# EAGLE schematic RasPi-BplusHAT (EAGLE 7.3.0)
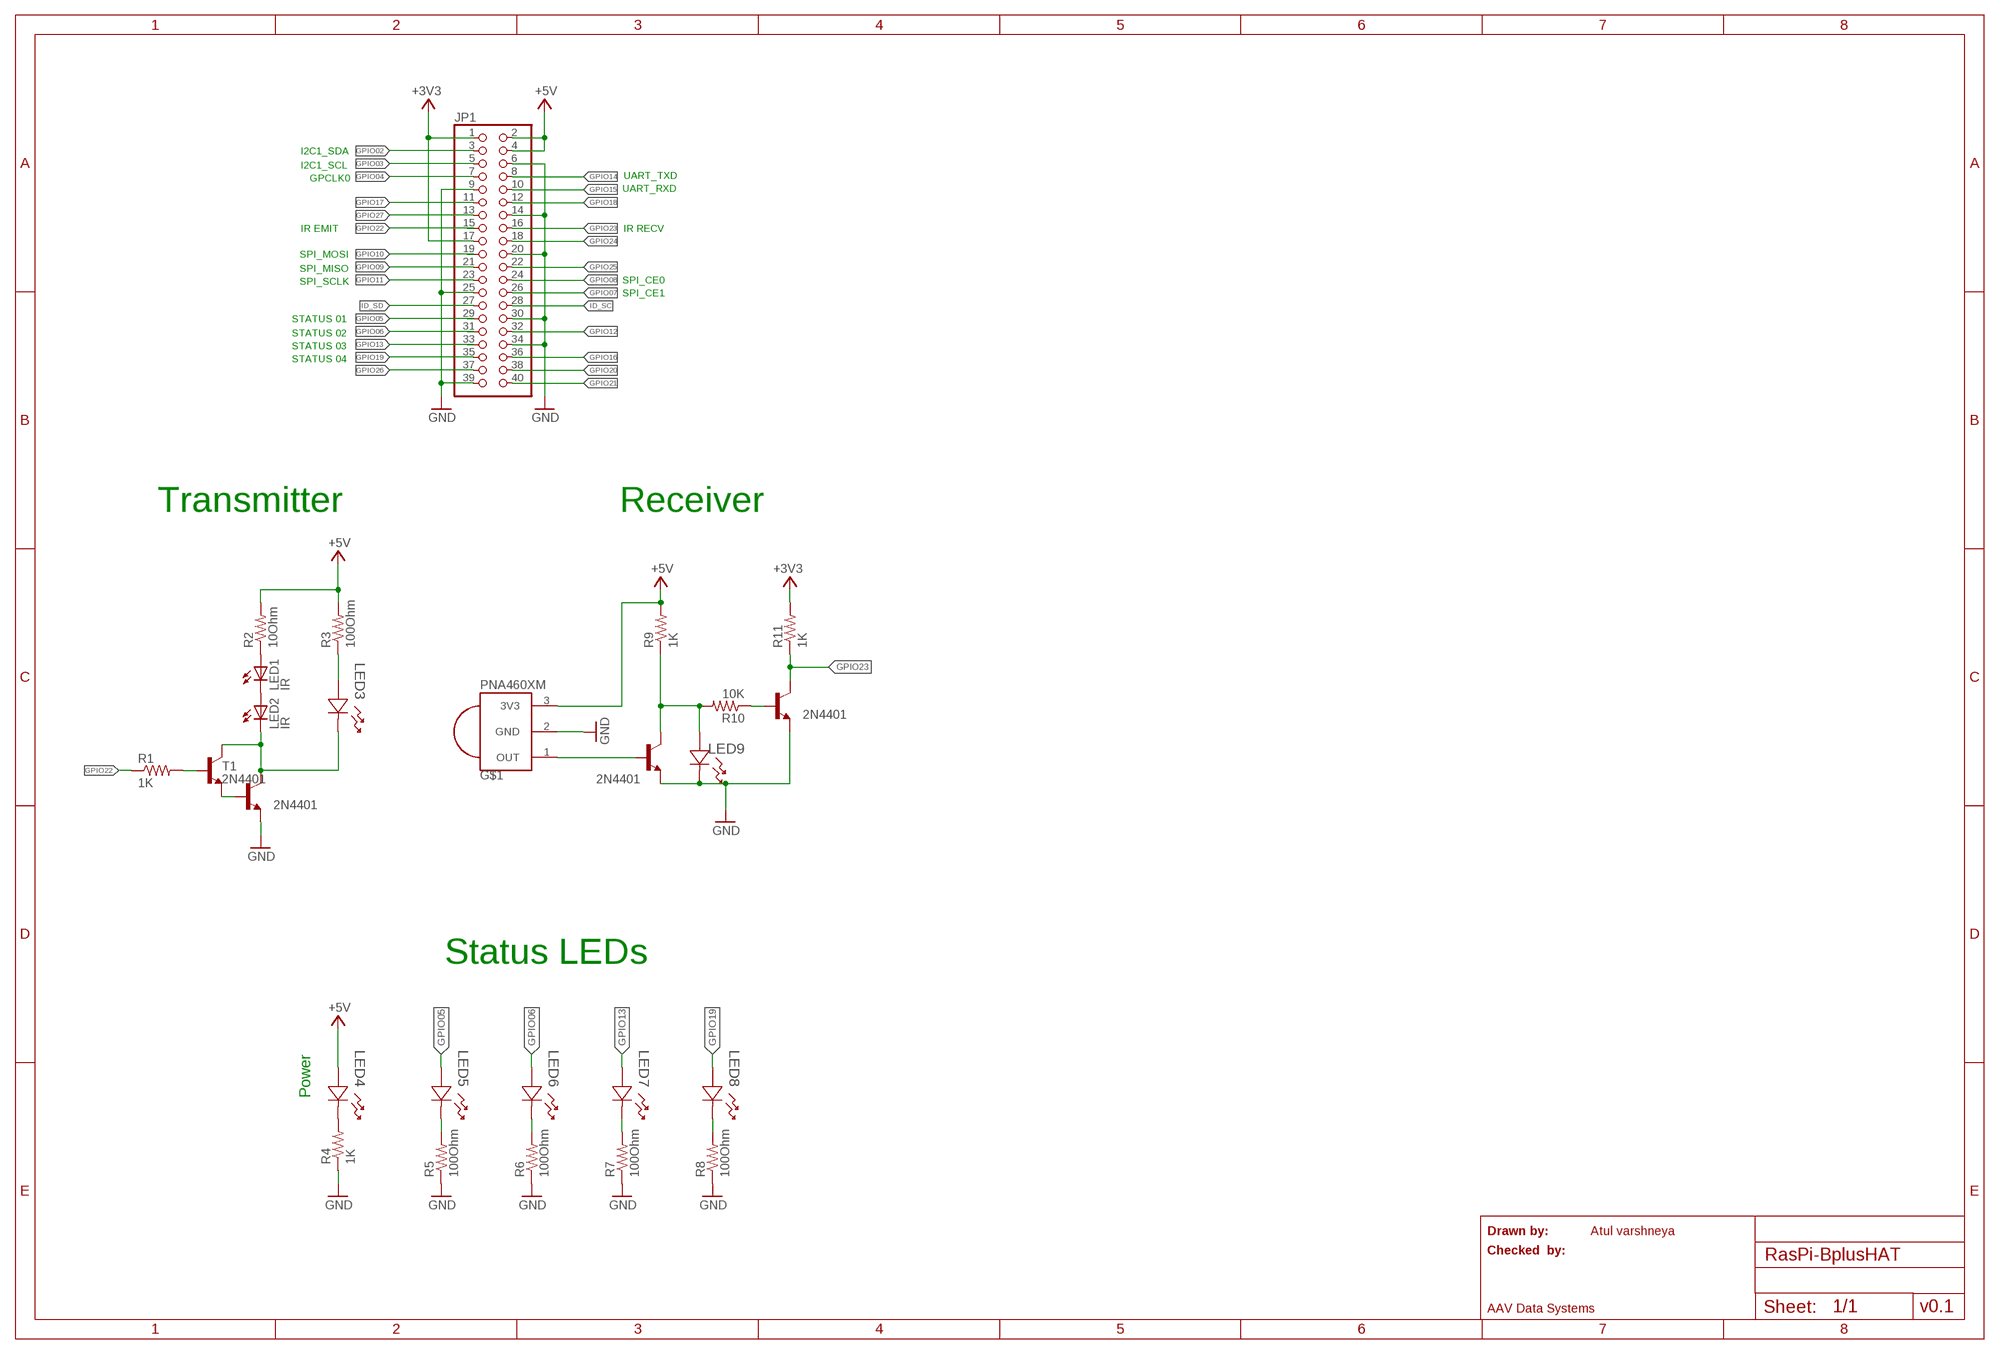
[diagram p0: schematic, sheet 1]

## Parts
G$1  PNA460XM  [PNA460XM]
JP1  PINHD-2X20  [2X20]
LED1  IR  LEDMICRO-SIDELED  [MICRO-SIDELED]
LED2  IR  LEDMICRO-SIDELED  [MICRO-SIDELED]
LED3  597-3401-407F  [LED_597-3401-407F]
LED4  597-3311-407F  [LED_597-3311-407F]
LED5  597-3311-407F  [LED_597-3311-407F]
LED6  597-3401-407F  [LED_597-3401-407F]
LED7  597-3111-407F  [LED_597-3111-407F]
LED8  597-3401-407F  [LED_597-3401-407F]
LED9  597-3401-407F  [LED_597-3401-407F]
R1  1K  R-US_R2010  [R2010]
R2  10Ohm  R-US_R2010  [R2010]
R3  100Ohm  R-US_R2010  [R2010]
R4  1K  R-US_R2010  [R2010]
R5  100Ohm  R-US_R2010  [R2010]
R6  100Ohm  R-US_R2010  [R2010]
R7  100Ohm  R-US_R2010  [R2010]
R8  100Ohm  R-US_R2010  [R2010]
R9  1K  R-US_R2010  [R2010]
R10  10K  R-US_R2010  [R2010]
R11  1K  R-US_R2010  [R2010]
T1  2N4401  MMBT4401LT1-NPN-SOT23-BEC  [SOT23-BEC]
T2  2N4401  MMBT4401LT1-NPN-SOT23-BEC  [SOT23-BEC]
T3  2N4401  MMBT4401LT1-NPN-SOT23-BEC  [SOT23-BEC]
T4  2N4401  MMBT4401LT1-NPN-SOT23-BEC  [SOT23-BEC]

## Nets
+3V3: JP1.1 JP1.17 R11.2
+5V: G$1.3(3V3) JP1.2 JP1.4 LED4.2 R2.2 R3.2 R9.2
GND: G$1.2(GND) JP1.6 JP1.9 JP1.14 JP1.20 JP1.25 JP1.30 JP1.34 JP1.39 LED9.1 R4.1 R5.1 R6.1 R7.1 R8.1 T2.E T3.E T4.E
GPIO02: JP1.3
GPIO03: JP1.5
GPIO04: JP1.7
GPIO05: JP1.29 LED5.2
GPIO06: JP1.31 LED6.2
GPIO07: JP1.26
GPIO08: JP1.24
GPIO09: JP1.21
GPIO10: JP1.19
GPIO11: JP1.23
GPIO12: JP1.32
GPIO13: JP1.33 LED7.2
GPIO14: JP1.8
GPIO15: JP1.10
GPIO16: JP1.36
GPIO17: JP1.11
GPIO18: JP1.12
GPIO19: JP1.35 LED8.2
GPIO20: JP1.38
GPIO21: JP1.40
GPIO22: JP1.15 R1.1
GPIO23: JP1.16 R11.1 T4.C
GPIO24: JP1.18
GPIO25: JP1.22
GPIO26: JP1.37
GPIO27: JP1.13
ID_SC: JP1.28
ID_SD: JP1.27
N$2: LED1.A R2.1
N$3: LED1.C LED2.A
N$4: LED2.C LED3.1 T1.C T2.C
N$5: R1.2 T1.B
N$6: LED3.2 R3.1
N$7: LED5.1 R5.2
N$8: G$1.1(OUT) T3.B
N$10: LED9.2 R9.1 R10.2 T3.C
N$11: T1.E T2.B
N$14: LED8.1 R8.2
N$16: LED7.1 R7.2
N$17: LED6.1 R6.2
N$21: LED4.1 R4.2
N$23: R10.1 T4.B

## Notes on the sheet
- I2C1_SDA
- I2C1_SCL
- GPCLK0 | UART_TXD
- UART_RXD
- IR EMIT | IR RECV
- SPI_MOSI
- SPI_MISO
- SPI_SCLK | SPI_CE0
- SPI_CE1
- STATUS 01
- STATUS 02
- STATUS 03
- STATUS 04
- Receiver
- Transmitter
- Status LEDs
- Power
- Drawn by: | Atul varshneya
- Checked  by:
- AAV Data Systems | v0.1

## Library data of the parts
G$1 = adafruit:PNA460XM: IR 38KHz receiver PNA4602 and related receivers http://www.ladyada.net/library/pcb/eaglelibrary.html; MPN: TSDP34138; OC_NEWARK: 68X1938
JP1 = adafruit:PINHD-2X20: PIN HEADER; OC_NEWARK: unknown
LED1 LED2 = led:LED: LED OSRAM: - CHIPLED LG R971, LG N971, LY N971, LG Q971, LY Q971, LO R971, LY R971 LH N974, LH R974 LS Q976, LO Q976, LY Q976 LO Q996 - Hyper CHIPLED LW Q18S LB Q993, LB Q99A, LB R99A - SideLED LS A670, LO A670, LY A670, LG A670, LP A670 LB A673, LV A673, LT A673, LW A673 LH A674 LY A675 LS A676, LA A676, LO A676, LY A676, LW A676 LS A679, LY A679, LG A679 - Hyper Micro SIDELED® LS Y876, LA Y876, LO Y876, LY Y876 LT Y87S - SmartLED LW L88C, LW L88S LB L89C, LB L89S, LG L890 LS L89K, LO L89K, LY L89K LS L896, LA L896, LO L896, LY L896 - TOPLED LS T670, LO T670, LY T670, LG T670, LP T670 LSG T670, LSP T670, LSY T670, LOP T670, LYG T670 LG T671, LOG T671, LSG T671 LB T673, LV T673, LT T673, LW T673 LH T674 LS T676, LA T676, LO T676, LY T676, LB T676, LH T676, LSB T676, LW T676 LB T67C, LV T67C, LT T67C, LS T67K, LO T67K, LY T67K, LW E67C LS E67B, LA E67B, LO E67B, LY E67B, LB E67C, LV E67C, LT E67C LW T67C LS T679, LY T679, LG T679 LS T770, LO T770, LY T770, LG T770, LP T770 LB T773, LV T773, LT T773, LW T773 LH T774 LS E675, LA E675, LY E675, LS T675 LS T776, LA T776, LO T776, LY T776, LB T776 LHGB T686 LT T68C, LB T68C - Hyper Mini TOPLED® LB M676 - Mini TOPLED Santana® LG M470 LS M47K, LO M47K, LY M47K Source: http://www.osram.convergy.de LUXEON: - LUMILED® LXK2-PW12-R00, LXK2-PW12-S00, LXK2-PW14-U00, LXK2-PW14-V00 LXK2-PM12-R00, LXK2-PM12-S00, LXK2-PM14-U00 LXK2-PE12-Q00, LXK2-PE12-R00, LXK2-PE12-S00, LXK2-PE14-T00, LXK2-PE14-U00 LXK2-PB12-K00, LXK2-PB12-L00, LXK2-PB12-M00, LXK2-PB14-N00, LXK2-PB14-P00, LXK2-PB14-Q00 LXK2-PR12-L00, LXK2-PR12-M00, LXK2-PR14-Q00, LXK2-PR14-R00 LXK2-PD12-Q00, LXK2-PD12-R00, LXK2-PD12-S00 LXK2-PH12-R00, LXK2-PH12-S00 LXK2-PL12-P00, LXK2-PL12-Q00, LXK2-PL12-R00 Source: www.luxeon.com KINGBRIGHT: KA-3528ASYC Source: www.kingbright.com; MPN: VSMB10940X01; OC_NEWARK: 64X9433
LED3 LED6 LED8 LED9 = Dialight_By_element14_Batch_1:597-3401-407F: LED 1206 Yellow SMT; COLOR: Yellow; MPN: 597-3401-407F; OC_FARNELL: 1519495; OC_NEWARK: 30K4970; PACKAGE: 1206-Yellow LED; SUPPLIER: Dialight
LED4 LED5 = Dialight_By_element14_Batch_1:597-3311-407F: LED 1206 Green SMT; COLOR: Green; MPN: 597-3311-407F; OC_FARNELL: 1519493; OC_NEWARK: 30K4957; PACKAGE: 1206- Green LED; SUPPLIER: Dialight
LED7 = Dialight_By_element14_Batch_1:597-3111-407F: LED 1206 ALGAAS RED SMT; COLOR: AlGaAs Red; MPN: 597-3111-407F; OC_FARNELL: 1519490; OC_NEWARK: 30K4900; PACKAGE: 1206-RED LED; SUPPLIER: Dialight
R1 R4 R9 R11 = adafruit:R-US_: RESISTOR, American symbol; MF: VISHAY/DALE; MPN: CRCW08051K00JNEA; OC_NEWARK: 52K9725
R2 = adafruit:R-US_: RESISTOR, American symbol; MF: OUTSOURCE ITEM; MPN: RP2012S-100-F; OC_NEWARK: 28K1497
R3 R5-R8 = adafruit:R-US_: RESISTOR, American symbol; MPN: CRCW0805100RJNTA; OC_NEWARK: 57K6355
R10 = adafruit:R-US_: RESISTOR, American symbol; MF: VISHAY/DALE; MPN: CRCW080510K0JNEB; OC_NEWARK: 65J1362
T1 T2 = transistor-neu-to92:*-NPN-: NPN Transistror BF959 corrected 2008.03.06; MPN: MMBT4401-TP; OC_NEWARK: 51T4931
T3 T4 = transistor:*-NPN-: NPN Transistror BF959 corrected 2008.03.06; MPN: MMBT4401-TP; OC_NEWARK: 51T4931